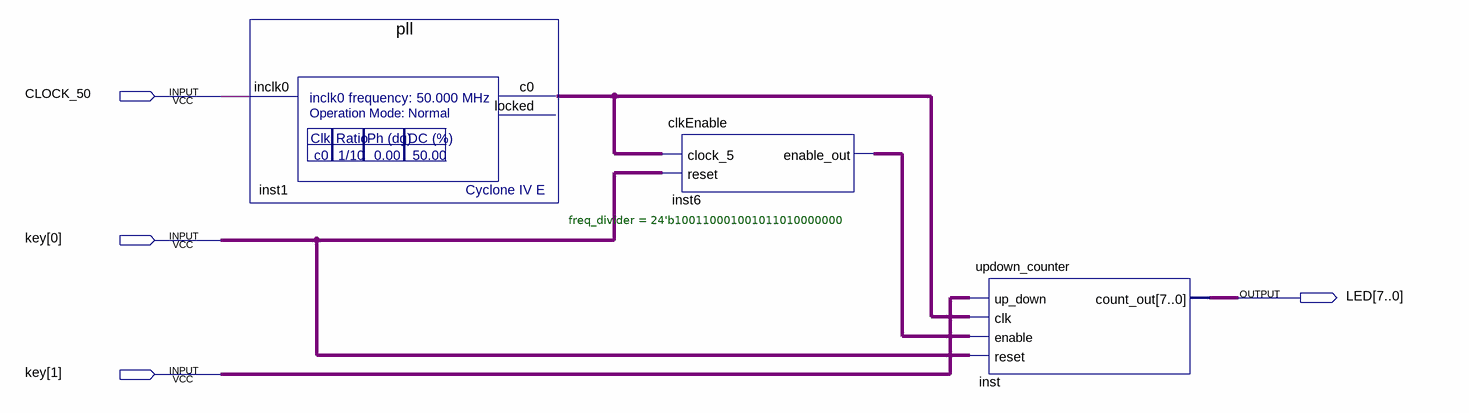
[diagram p0: schematic sheet]
// Quartus schematic my_first_fpga.bdf as structural Verilog: 3 symbols, 4 pins
module my_first_fpga (
  input  CLOCK_50,
  input  [1:0] key,
  output [7:0] LED
);

  wire inst1_c0, inst6_enable_out;

  pll inst1 (.inclk0(CLOCK_50), .c0(inst1_c0));  // open: locked
  clkEnable #(.freq_divider(24'b100110001001011010000000)) inst6 (
    .clock_5(inst1_c0), .reset(key[0]), .enable_out(inst6_enable_out));
  updown_counter inst (.up_down(key[1]), .clk(inst1_c0), .enable(inst6_enable_out), .reset(key[0]), .count_out(LED));
endmodule
